# EAGLE board harp behavior v2.0 (EAGLE 9.6.2)
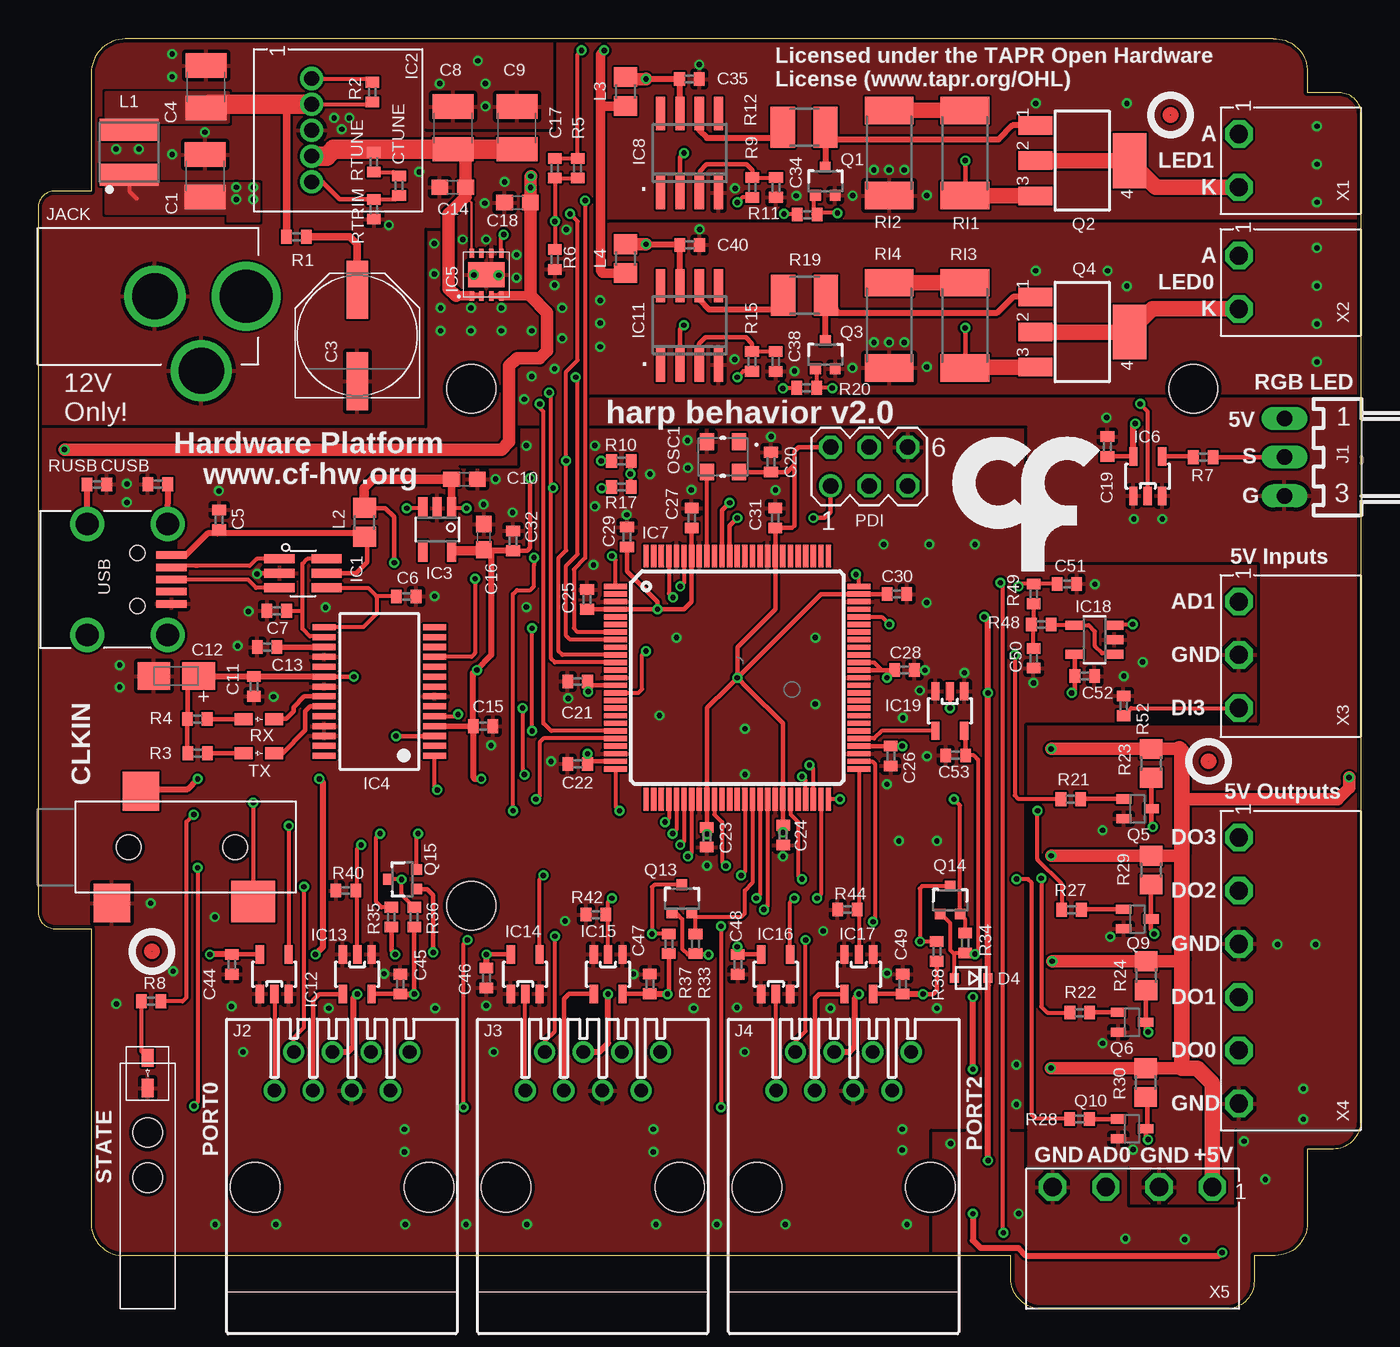
[diagram p4: board, top side]
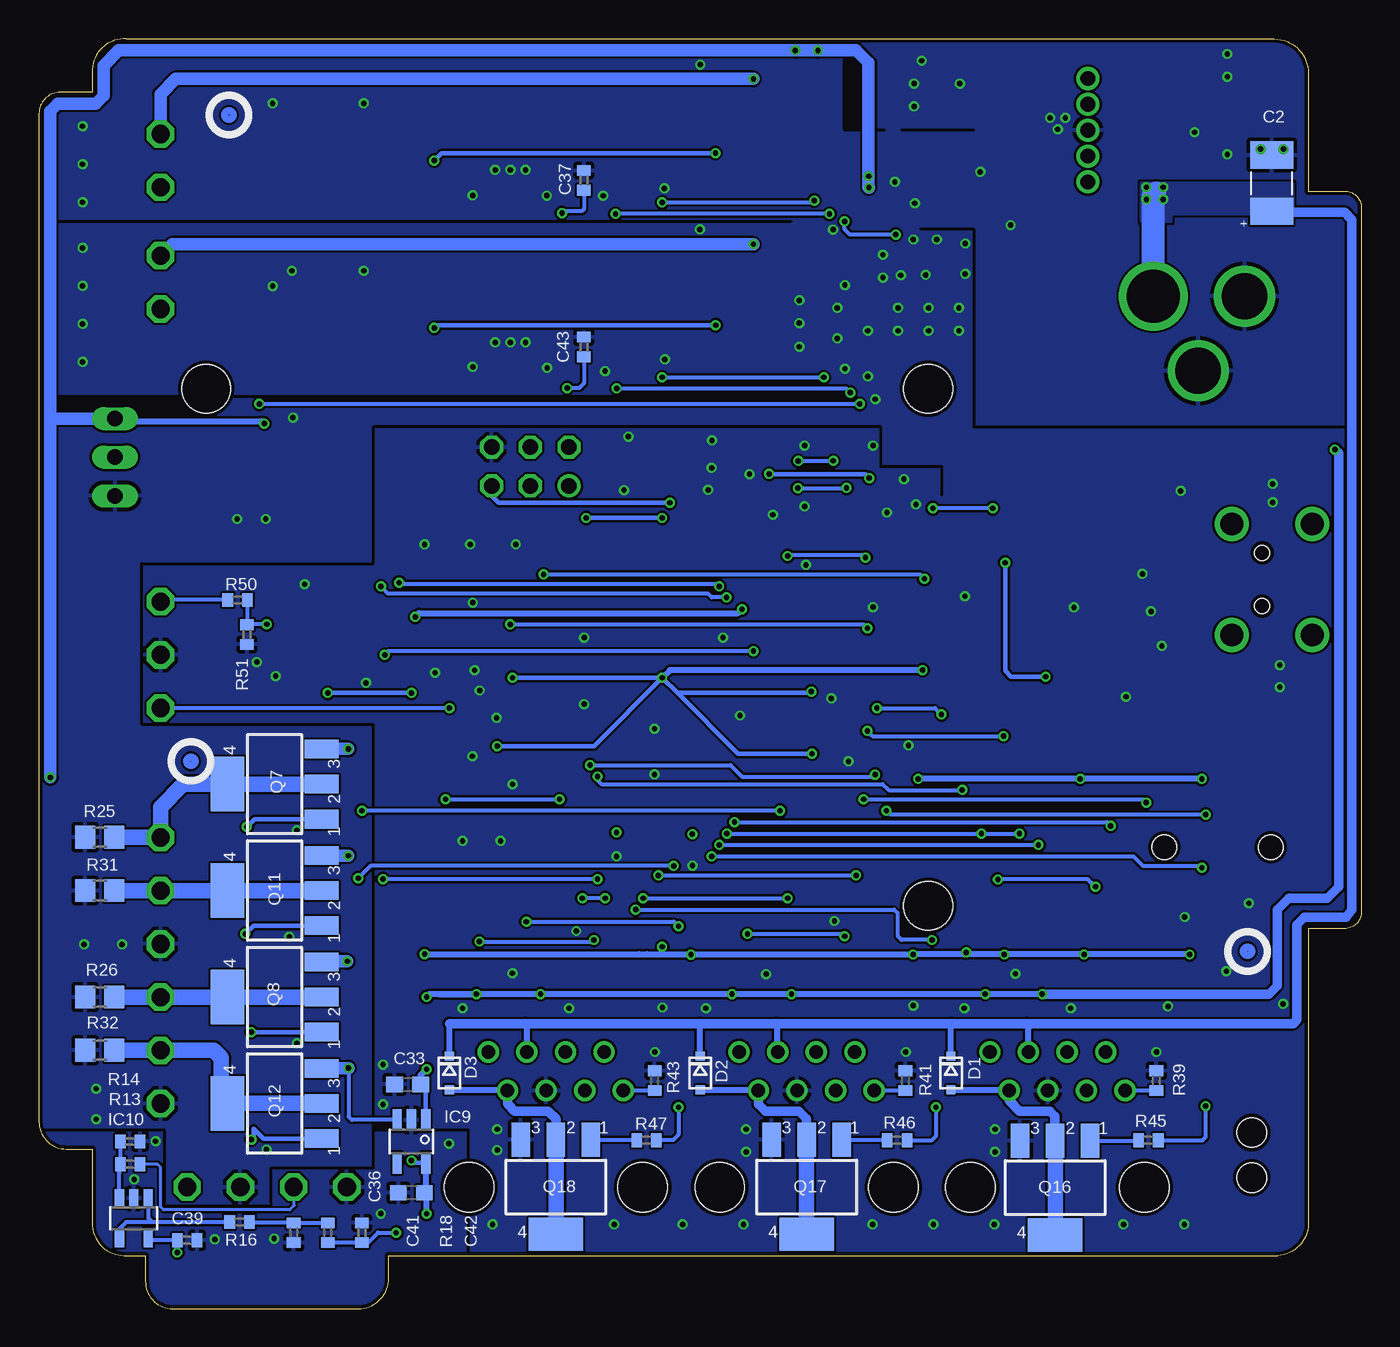
[diagram p5: board, bottom side, seen from below]

Size 87 x 83.5 mm. Coordinates in mm from the lower left corner, seen from the top.
Outline: 3.5,81.26 3.5,73.5 1.12,73.5 arc90 0,72.38 0,26.12 arc90 1.12,25 3.5,25 3.5,5.74 arc90 5.5,3.5 64,3.5 64,1.99 arc90 65.99,0 78.2,0 arc90 80,1.8 80,3.5 81.39,3.5 arc90 83.5,5.61 83.5,10.5 85.2,10.5 arc90 87,12.3 87,78.59 arc90 85.59,80 83.5,80 83.5,81.5 arc90 81.26,83.5 5.74,83.5 arc90 3.5,81.26
Copper layers (1*16): Top 0.035mm / dielectric 1.5mm / Bottom 0.035mm
Design rules "SeeedStudio_2layer_DRU_no_angle_20140221": minimum track width 6mil, minimum drill 12mil, track to track 6mil, track to pad 6mil, pad to pad 6mil, via to via 6mil, smd to smd 0mil, copper to edge 10mil, drill to drill 10mil, minimum pad ring 10mil, minimum via ring 6mil, stop-mask expansion 2mil, vias tented up to drill 100mil, thermal gap 10mil
Holes 3.2 mm at 28.5,60.5 28.5,26.5 76,60.5
tRestrict: 27 lines
bRestrict: 29 lines

## Footprints (pad centres in the part's own frame; a part is rotated, then mirrored left to right if it is on the bottom)
C1210 = smd 1.6 x 2.7: 1 -1.4,0; 2 1.4,0
CAP_100UF_HAND = smd 1.8 x 2.8: + -1.85,0; - 1.85,0
PANASONIC_E = smd 3.8 x 1.4: + 3,0; - -3,0
C0402 = smd 0.7 x 0.9: 1 -0.65,0; 2 0.65,0
C0603 = smd 1.1 x 1: 1 -0.85,0; 2 0.85,0
A/3216-18W = smd 2.15 x 1.8: + 1.475,0; - -1.475,0
35RASMT2BHNTRX = smd 2.4 x 2.55: 1 0.8,3.675; 5 -1.1,-3.675 | smd 2.9 x 2.75: 4 8.2,-3.575 | hole 1.6: 0,0; 7,0
SOD-323-DIODE = smd 0.6 x 0.6: A 1.1,0; C -1.1,0
SOT23-6L = smd 0.6 x 2: P$1 -0.95,-1.55; P$2 0,-1.55; P$3 0.95,-1.55; P$4 0.95,1.55; P$5 0,1.55; P$6 -0.95,1.55
SIP-5 = drill 0.97 pad 1.52: P1 -3.4,0; P2 -1.7,0; P3 0,0; P4 1.7,0; P5 3.4,0
TSOT23-5 = smd 0.6 x 1.408: 1 -0.95,-1.404; 2 0,-1.404; 3 0.95,-1.404; 4 0.95,1.404; 5 -0.95,1.404
SSOP28 = smd 0.4 x 1.5: 1 -4.225,-3.625; 2 -3.575,-3.625; 3 -2.925,-3.625; 4 -2.275,-3.625; 5 -1.625,-3.625; 6 -0.975,-3.625; 7 -0.325,-3.625; 8 0.325,-3.625; 9 0.975,-3.625; 10 1.625,-3.625; 11 2.275,-3.625; 12 2.925,-3.625; 13 3.575,-3.625; 14 4.225,-3.625; 15 4.225,3.625; 16 3.575,3.625; 17 2.925,3.625; 18 2.275,3.625; 19 1.625,3.625; 20 0.975,3.625; 21 0.325,3.625; 22 -0.325,3.625; 23 -0.975,3.625; 24 -1.625,3.625; 25 -2.275,3.625; 26 -2.925,3.625; 27 -3.575,3.625; 28 -4.225,3.625
SON-8 = smd 0.3 x 0.6: P1 -0.975,-1.4; P2 -0.325,-1.4; P3 0.325,-1.4; P4 0.975,-1.4; P5 0.975,1.4; P6 0.325,1.4; P7 -0.325,1.4; P8 -0.975,1.4 | smd 2.4 x 1.65: P9 0,0
SOT23-5 = smd 0.55 x 1.2: 1 -0.95,-1.3; 2 0,-1.3; 3 0.95,-1.3; 4 0.95,1.3; 5 -0.95,1.3
TQFP100 = smd 1.5 x 0.35: 1 -8,6; 2 -8,5.5; 3 -8,5; 4 -8,4.5; 5 -8,4; 6 -8,3.5; 7 -8,3; 8 -8,2.5; 9 -8,2; 10 -8,1.5; 11 -8,1; 12 -8,0.5; 13 -8,0; 14 -8,-0.5; 15 -8,-1; 16 -8,-1.5; 17 -8,-2; 18 -8,-2.5; 19 -8,-3; 20 -8,-3.5; 21 -8,-4; 22 -8,-4.5; 23 -8,-5; 24 -8,-5.5; 25 -8,-6; 51 8,-6; 52 8,-5.5; 53 8,-5; 54 8,-4.5; 55 8,-4; 56 8,-3.5; 57 8,-3; 58 8,-2.5; 59 8,-2; 60 8,-1.5; 61 8,-1; 62 8,-0.5; 63 8,0; 64 8,0.5; 65 8,1; 66 8,1.5; 67 8,2; 68 8,2.5; 69 8,3; 70 8,3.5; 71 8,4; 72 8,4.5; 73 8,5; 74 8,5.5; 75 8,6 | smd 0.35 x 1.5: 26 -6,-8; 27 -5.5,-8; 28 -5,-8; 29 -4.5,-8; 30 -4,-8; 31 -3.5,-8; 32 -3,-8; 33 -2.5,-8; 34 -2,-8; 35 -1.5,-8; 36 -1,-8; 37 -0.5,-8; 38 0,-8; 39 0.5,-8; 40 1,-8; 41 1.5,-8; 42 2,-8; 43 2.5,-8; 44 3,-8; 45 3.5,-8; 46 4,-8; 47 4.5,-8; 48 5,-8; 49 5.5,-8; 50 6,-8; 76 6,8; 77 5.5,8; 78 5,8; 79 4.5,8; 80 4,8; 81 3.5,8; 82 3,8; 83 2.5,8; 84 2,8; 85 1.5,8; 86 1,8; 87 0.5,8; 88 0,8; 89 -0.5,8; 90 -1,8; 91 -1.5,8; 92 -2,8; 93 -2.5,8; 94 -3,8; 95 -3.5,8; 96 -4,8; 97 -4.5,8; 98 -5,8; 99 -5.5,8; 100 -6,8
SO8 = smd 0.6 x 2.2: 1 -1.905,-2.6; 2 -0.635,-2.6; 3 0.635,-2.6; 4 1.905,-2.6; 5 1.905,2.6; 6 0.635,2.6; 7 -0.635,2.6; 8 -1.905,2.6
SOT23-5' = smd 0.6 x 1.2: 1 -0.95,-1.306; 2 0,-1.306; 3 0.95,-1.306; 4 0.95,1.306; 5 -0.95,1.306
7395-03 = drill 1.016 long: 1 2.54,0; 2 0,0; 3 -2.54,0
520426-4 = drill 0.889: 1 -4.445,6.35; 2 -3.175,8.89; 3 -1.905,6.35; 4 -0.635,8.89; 5 0.635,6.35; 6 1.905,8.89; 7 3.175,6.35; 8 4.445,8.89 | hole 3.251: -5.715,0; 5.715,0
DC_POWER_INPUT_2.1MM = drill 3.5: P1 8.5,0 | drill 3: P2 2.5,0; P3 5.55,-4.9
IND_LPS4012_V2 = smd 1.45 x 3.89: 1 -1.475,0; 2 1.475,0
R0805 = smd 1.3 x 1.5: 1 -0.95,0; 2 0.95,0
OSCILLATOR_3.2X2.5 = smd 0.9 x 1.1: P$1 -1.05,-1; P$2 1.05,-1; P$3 1.05,1; P$4 -1.05,1
MA03-2 = drill 1.016: 1 -2.54,-1.27 | drill 1.016 octagon: 2 -2.54,1.27; 3 0,-1.27; 4 0,1.27; 5 2.54,-1.27; 6 2.54,1.27
SOT323 = smd 0.7 x 0.7: 1 -0.65,-0.925; 2 0.65,-0.925; 3 0,0.925
SOT223 = smd 1.219 x 2.235: 1 -2.311,-3.099; 2 0,-3.099; 3 2.311,-3.099 | smd 3.6 x 2.2: 4 0,3.099
SOT323-BEC = smd 0.6 x 1: B -0.65,-0.9; C 0,0.9; E 0.65,-0.9
R0402 = smd 0.7 x 0.9: 1 -0.65,0; 2 0.65,0
R1210 = smd 1.6 x 2.7: 1 -1.4,0; 2 1.4,0
R2512 = smd 1.8 x 3.2: 1 -2.8,0; 2 2.8,0
LED_HAND = smd 1.2 x 0.8: A -1,0; K 1,0
LED_PIPE_7513D2-L = hole 1.93: -1.486,0; 1.486,0
240-0002-1 = smd 0.5 x 2: P$1 -1.6,8.65; P$2 -0.8,8.65; P$3 0,8.65; P$4 0.8,8.65; P$5 1.6,8.65 | drill 1.5: SHIELD_1 -3.65,3.1; SHIELD_2 3.65,3.1; SHIELD_3 3.65,8.4; SHIELD_4 -3.65,8.4 | hole 1: -1.75,6.4; 1.75,6.4
CON_3.5MM_1X2 = drill 1.2 octagon: P1 -1.75,0; P2 1.75,0
CON_3.5MM_1X3 = drill 1.2 octagon: P1 -3.5,0; P2 0,0; P3 3.5,0
CON_3.5MM_1X6 = drill 1.2 octagon: P1 -8.44,-2.54; P2 -4.94,-2.54; P3 -1.44,-2.54; P4 2.06,-2.54; P5 5.56,-2.54; P6 9.06,-2.54
CON_3.5MM_1X4 = drill 1.2 octagon: P1 -5.25,0; P2 -1.75,0; P3 1.75,0; P4 5.25,0

## Placement (x,y rotation side)
C1  22uF  [C1210]  11,74.5 90 top
C2  22uF  [CAP_100UF_HAND]  5.9,74.02 90 bottom
C3  100uF  [PANASONIC_E]  21,64 90 top
C4  22uF  [C1210]  11.05,80.35 90 top
C5  100nF  [C0402]  11.92,51.88 90 top
C6  47pF  [C0402]  24.22,46.84 0 top
C7  47pF  [C0402]  15.71,45.9 180 top
C8  47uF  [C1210]  27.3,77.65 90 top
C9  47uF  [C1210]  31.5,77.65 90 top
C10  10uF  [C0603]  28.05,54.54 0 top
C11  100nF  [C0402]  14.21,40.93 270 top
C12  4.7uF  [A/3216-18W]  9.09,41.61 0 top
C13  100nF  [C0402]  15.08,43.51 180 top
C14  10uF  [C0603]  27.28,73.76 180 top
C15  100nF  [C0402]  29.28,38.3 0 top
C16  10uF  [C0603]  29.33,50.75 90 top
C17  13pF  [C0402]  34,75 270 top
C18  10uF  [C0603]  31.54,72.74 180 top
C19  100nF  [C0402]  70.35,56.7 90 top
C20  100nF  [C0402]  48.22,55.67 90 top
C21  100nF  [C0402]  35.5,41.25 180 top
C22  100nF  [C0402]  35.5,35.83 180 top
C23  100nF  [C0402]  44,31.01 270 top
C24  100nF  [C0402]  49.01,31.15 270 top
C25  100nF  [C0402]  36.11,46.65 90 top
C26  100nF  [C0402]  56.1,36.35 270 top
C27  100nF  [C0402]  43,52 90 top
C28  100nF  [C0402]  57,42 0 top
C29  330nF  [C0402]  38.75,50.75 90 top
C30  100nF  [C0402]  56.5,47 0 top
C31  100nF  [C0402]  48.5,52 90 top
C32  330nF  [C0402]  31.25,50.5 90 top
C33  10uF  [C0603]  62.75,14.75 180 bottom
C34  NA  [C0402]  48.55,73.74 270 top
C35  100nF  [C0402]  42.85,80.87 0 top
C36  10uF  [C0603]  62.5,7.62 180 bottom
C37  100nF  [C0402]  51.15,74.2 90 bottom
C38  NA  [C0402]  48.53,62.29 270 top
C39  100nF  [C0402]  77.25,4.5 0 bottom
C40  100nF  [C0402]  42.86,69.96 0 top
C41  15nF 5%  [C0402]  70.25,5 90 bottom
C42  15nF 5%  [C0402]  65.75,5 270 bottom
C43  100nF  [C0402]  51.15,63.25 90 bottom
C44  100nF  [C0402]  12.75,22.65 270 top
C45  100nF  [C0402]  23.83,21.35 90 top
C46  100nF  [C0402]  29.5,21.75 270 top
C47  100nF  [C0402]  40.25,21.36 90 top
C48  100nF  [C0402]  46.04,22.64 270 top
C49  100nF  [C0402]  56.88,21.34 90 top
C50  15nF 5%  [C0402]  65.49,42.78 90 top
C51  15nF 5%  [C0402]  67.68,47.66 180 top
C52  100nF  [C0402]  68.86,41.61 0 top
C53  100nF  [C0402]  60.37,36.39 180 top
CLKIN  [35RASMT2BHNTRX]  5.96,30.36 0 top
CTUNE  NA  [C0402]  23.75,73.85 270 top
CUSB  4.7nF  [C0402]  7.88,54.22 180 top
D1  NA  [SOD-323-DIODE]  27,15.5 270 bottom
D2  NA  [SOD-323-DIODE]  43.5,15.5 270 bottom
D3  NA  [SOD-323-DIODE]  60,15.5 270 bottom
D4  NA  [SOD-323-DIODE]  61.38,21.75 180 top
IC1  USBLC6-2SC6  [SOT23-6L]  17.44,48.36 270 top
IC2  DC-DC-SIP-5  [SIP-5]  18,77.5 270 top
IC3  LP5907MFX-3.3  [TSOT23-5]  26.27,51.24 180 top
IC4  FT232RL  [SSOP28]  22.45,40.59 90 top
IC5  TPS78601SON  [SON-8]  29.5,68 0 top
IC6  M74VHC1GT50DTT1G  [SOT23-5]  73,54.75 0 top
IC7  XMEGA-A1TQFP  [TQFP100]  46,41.5 0 top
IC8  [SO8]  42.86,76 0 top
IC9  LP5907MFX-3.3  [TSOT23-5]  62.5,11 180 bottom
IC10  OPA365  [SOT23-5']  80.76,5.95 180 bottom
IC11  [SO8]  42.86,64.67 0 top
IC12  SN74LVC1G125  [SOT23-5]  15.54,22 0 top
IC13  M74VHC1GT50DTT1G  [SOT23-5]  21,22 180 top
IC14  SN74LVC1G125  [SOT23-5]  32.05,22 0 top
IC15  M74VHC1GT50DTT1G  [SOT23-5]  37.5,22 180 top
IC16  SN74LVC1G125  [SOT23-5]  48.53,22 0 top
IC17  M74VHC1GT50DTT1G  [SOT23-5]  54,22 180 top
IC18  OPA365  [SOT23-5']  69.5,44 90 top
IC19  SN74LVC1G125  [SOT23-5]  59.98,39.31 180 top
J1  22-05-7038-03  [7395-03]  82,56 90 top
J2  Port 0  [520426-4]  20,8 0 top
J3  Port 1  [520426-4]  36.5,8 0 top
J4  Port 2  [520426-4]  53,8 0 top
JACK  DC_JACK2.1MM  [DC_POWER_INPUT_2.1MM]  5.19,66.58 0 top
L1  1.5u  [IND_LPS4012_V2]  6,76.05 90 top
L2  ???  [R0805]  21.48,51.72 270 top
L3  600@100M  [R0805]  38.65,80.04 90 top
L4  600@100M  [R0805]  38.65,69.06 90 top
OSC1  OSCILLATOR  [OSCILLATOR_3.2X2.5]  45.06,56.02 180 top
PDI  [MA03-2]  54.68,55.39 0 top
Q1  MOSFET-NCHANNELSOT323  [SOT323]  51.79,74.15 0 top
Q2  [SOT223]  68.7,75.5 270 top
Q3  MOSFET-NCHANNELSOT323  [SOT323]  51.8,62.74 0 top
Q4  [SOT223]  68.7,64.23 270 top
Q5  BC817-40W  [SOT323-BEC]  72.33,32.88 270 top
Q6  BC817-40W  [SOT323-BEC]  71.96,18.84 270 top
Q7  [SOT223]  71.5,34.5 90 bottom
Q8  [SOT223]  71.5,20.5 90 bottom
Q9  BC817-40W  [SOT323-BEC]  72.32,25.63 270 top
Q10  BC817-40W  [SOT323-BEC]  71.96,11.83 270 top
Q11  [SOT223]  71.5,27.5 90 bottom
Q12  [SOT223]  71.5,13.5 90 bottom
Q13  MOSFET-NCHANNELSOT323  [SOT323]  42.35,26.95 0 top
Q14  MOSFET-NCHANNELSOT323  [SOT323]  60,26.88 0 top
Q15  MOSFET-NCHANNELSOT323  [SOT323]  23.98,28.25 90 top
Q16  [SOT223]  20.15,7.96 180 bottom
Q17  [SOT223]  36.5,8 180 bottom
Q18  [SOT223]  53,8 180 bottom
R1  0  [R0402]  17,70.5 180 top
R2  NA  [R0402]  22,80 270 top
R3  2050 NA  [R0402]  10.5,36.53 180 top
R4  680 NA  [R0402]  10.48,38.77 180 top
R5  95.3k  [R0402]  35.5,75 90 top
R6  30.9k  [R0402]  34,69 90 top
R7  100  [R0402]  76.65,56 180 top
R8  68  [R0402]  7.44,20.22 0 top
R9  0  [R0402]  46.99,73.73 90 top
R10  100k  [R0402]  38.38,55.75 180 top
R11  100  [R0402]  50.6,71.95 0 top
R12  200  [R1210]  50.4,77.7 0 top
R13  24k  [R0402]  81,9.5 0 bottom
R14  15k  [R0402]  81,11 180 bottom
R15  0  [R0402]  46.97,62.3 90 top
R16  10k 1%  [R0402]  73.8,5.7 0 bottom
R17  100k  [R0402]  38.38,54.04 180 top
R18  10k 1%  [R0402]  68,5 270 bottom
R19  200  [R1210]  50.43,66.65 0 top
R20  100  [R0402]  50.56,60.56 0 top
R21  10k  [R0402]  67.94,33.51 0 top
R22  10k  [R0402]  68.53,19.47 0 top
R23  549  [R0805]  73.22,35.86 270 top
R24  549  [R0805]  72.89,21.9 270 top
R25  549  [R0805]  83,31 0 bottom
R26  549  [R0805]  83,20.5 0 bottom
R27  10k  [R0402]  67.98,26.23 0 top
R28  10k  [R0402]  68.51,12.48 0 top
R29  549  [R0805]  73.22,28.84 270 top
R30  549  [R0805]  72.86,14.87 270 top
R31  549  [R0805]  83,27.5 0 bottom
R32  549  [R0805]  83,17 0 bottom
R33  10k  [R0402]  43.25,24 90 top
R34  10k  [R0402]  60.99,24.05 90 top
R35  10k  [R0402]  23.25,25.75 90 top
R36  10k  [R0402]  24.75,25.75 90 top
R37  10k  [R0402]  41.5,24 90 top
R38  10k  [R0402]  59.12,23.5 90 top
R39  100k  [R0402]  13.5,15 90 bottom
R40  100k  [R0402]  20.25,27.5 0 top
R41  100k  [R0402]  30,15 90 bottom
R42  100k  [R0402]  36.7,25.92 0 top
R43  100k  [R0402]  46.5,15 90 bottom
R44  100k  [R0402]  53.25,26.25 180 top
R45  330  [R0402]  14.02,11.08 180 bottom
R46  330  [R0402]  30.54,11.08 180 bottom
R47  330  [R0402]  47.03,11.08 180 bottom
R48  10k 1%  [R0402]  66,45 180 top
R49  10k 1%  [R0402]  65.5,47.01 90 top
R50  24k  [R0402]  73.93,46.61 180 bottom
R51  15k  [R0402]  73.31,44.33 90 bottom
R52  100k  [R0402]  71.41,39.64 90 top
RI1  4.99  [R2512]  60.98,76 270 top
RI2  4.99  [R2512]  56,76 90 top
RI3  4.99  [R2512]  60.98,64.67 270 top
RI4  4.99  [R2512]  56,64.67 90 top
RTRIM  243  [R0402]  22.1,72.3 90 top
RTUNE  NA  [R0402]  22.1,75.4 90 top
RUSB  1M  [R0402]  3.87,54.2 0 top
RX  GREEN NA  [LED_HAND]  14.53,38.77 0 top
STATE  GREEN  [LED_HAND]  7.21,15.51 270 top
TX  RED NA  [LED_HAND]  14.53,36.53 0 top
U$1  [LED_PIPE_7513D2-L]  7.21,10.11 90 top
U$2  [FIDUCIAL]  77,36 0 top
U$3  [FIDUCIAL]  74.5,78.5 0 top
U$4  [FIDUCIAL]  7.5,23.5 0 top
U$5  [FIDUCIAL]  7.5,23.5 0 bottom
U$6  [FIDUCIAL]  77,36 0 bottom
U$7  [FIDUCIAL]  74.5,78.5 0 bottom
U$9  [LOGO_6]  63.33,54.25 0 top
USB  [240-0002-1]  0.13,47.96 270 top
X1  CON_3.5MM_1X2  [CON_3.5MM_1X2]  79,75.5 270 top
X2  CON_3.5MM_1X2  [CON_3.5MM_1X2]  79,67.5 270 top
X3  CON_3.5MM_1X3  [CON_3.5MM_1X3]  79,43 270 top
X4  CON_3.5MM_1X6  [CON_3.5MM_1X6]  81.54,22.55 270 top
X5  CON_3.5MM_1X4  [CON_3.5MM_1X4]  72,8 180 top

## Tracks (layer width: path | path; a pad name or v marks a point on that pad's centre or on a via)
5V_RAW  (via drill 0.35 pad 0.65)
  Top 0.254: IC3.3 v24.27,52.65 v24.26,52.64 | v28.2,52.64 27.22,52.64 IC3.1
  Top 0.305: 16.31,41.56 C11.1 | v20.78,41.55 IC4.20 | R3.2 9.83,36.55 R4.2 9.84,38.79 9.84,41.45 9.7,41.59 10.56,41.59 C12.+ | v23.43,49.06 23.43,52.07 22.85,52.65 21.49,52.65 L2.1 | IC3.1
  Top 0.406: IC4.20 16.31,41.56 10.61,41.56 C12.+ | L2.1 21.54,52.72
  Top 0.508: IC3.1 C10.1
  Top 0.61: C10.1 22.05,54.55 21.45,53.95 21.45,52.69 L2.1
  Bottom 0.254: v24.26,52.64 v28.2,52.64
  Bottom 0.305: v23.43,49.06 23.43,41.96 23.06,41.57 22.7,41.57 v20.78,41.55
+5V  (via drill 0.35, 0.35 pad 0.65)
  Top 0.254: C17.1 R5.2 35.5,82.49 v35.76,82.75
  Top 0.305: C47.1 IC15.5 | IC17.5 57.13,20.7 C49.1 | IC13.5 C45.1 | R36.1 v24.75,20.7 | R37.1 41.5,20.79 v41.41,20.7 | R38.1 59.12,20.95 58.86,20.69 v58.23,20.69 v58.22,20.69 | C19.1 IC6.5
  Top 0.406: C45.1 v24.75,20.7 | v58.22,20.69 57.14,20.69 C49.1 | J2.4 20.39,16.89 20.75,17.25 20.75,20.45 v21,20.7 | v37.5,20.7 37.5,17.46 36.91,16.88 35.88,16.88 J3.4 | C47.1 41.23,20.71 v41.41,20.7 | J4.4 53.39,16.89 53.75,17.25 53.75,20.45 v54,20.7 | v61.5,15.75 v61.5,20.5 | IC6.5 72.05,58.08 v72.17,58.2 | IC5.P3 IC5.P4
  Top 0.61: 37,79 37,68.25 37.15,68.11 L4.1 | 37,79 37,82.5 v37.25,82.75 | L3.1 37.09,79.09 37,79 | IC5.P4 32.4,66.6
  Top 0.813: v66.65,36.81 R23.1 75.06,36.81 | 75.25,30 75.04,29.79 R29.1 v66.66,29.79 v66.65,29.79 | v66.72,22.85 66.92,22.85 R24.1 75.1,22.85 75.25,23 | 75.25,15.82 R30.1 66.66,15.82 v66.64,15.83 | v1.75,56.5 30.5,56.5 31,57 31,62 31.5,62.5 33,62.5 33.5,63 33.5,65.5 32.4,66.6 32.39,66.61 C18.1 | v86.25,34.94 86.25,34.25 85.5,33.5 75.25,33.5 | v32.4,73.72 32.4,72.76 C18.1 | C18.1 32.39,74.45 v32.42,74.48
  Top 1.016: X5.P1 77.25,14.82 76.25,15.82 75.25,15.82 75.25,23 75.25,30 75.25,33.5 75.25,36.63 75.06,36.81
  Bottom 0.254: IC9.3 63.46,12.42 66.42,12.42 66.64,12.64 v66.64,15.83
  Bottom 0.305: IC9.1 61.55,14.4 C33.1
  Bottom 0.406: 60.72,20.7 v54,20.7 v41.41,20.7 v37.5,20.7 v24.75,20.7 v21,20.7 IC13.5 | 60.72,20.7 v58.22,20.69 | C33.1 61.9,15.35 v61.5,15.75 | 60.72,20.7 61.3,20.7 v61.5,20.5 | 82.04,58.5 J1.1 81.83,58.37 72.34,58.37 v72.17,58.2
  Bottom 0.61: v21,20.7 6.1,20.7 5.55,21.25 5.55,26.25 4.8,27 2.25,27 1.5,27.75 1.5,56.25 v1.75,56.5
  Bottom 0.813: v66.65,29.79 68.29,29.79 Q11.3 | v66.65,36.81 68.29,36.81 Q7.3 | v66.72,22.85 68.36,22.85 Q8.3 | Q12.3 68.38,15.83 v66.64,15.83 | v86.25,34.94 86.25,58.5 | 86.25,58.5 86.25,78.75 85.75,79.25 83.25,79.25 82.75,79.75 82.75,81.75 81.75,82.75 v37.25,82.75 v35.76,82.75 33.25,82.75 32.42,81.92 v32.42,74.48 32.42,73.74 v32.4,73.72 | J1.1 86.21,58.54 86.25,58.5
+12V  (via drill 0.35 pad 0.65)
  Top 0.254: L1.1 6,73.5 6.5,73
  Bottom 0.254: C2.+ 5.9,72.1 6,72
  Bottom 0.406: J2.6 21.91,18.66 | D1.C 27,18.75 | J3.6 38.41,18.66 38.5,18.75 | D2.C 43.5,18.75 | J4.6 54.91,18.66 55,18.75 | D3.C 60,18.75
  Bottom 0.61: 60,18.75 55,18.75 43.5,18.75 38.5,18.75 27,18.75 22,18.75 | 21.91,18.66 22,18.75 | 22,18.75 4.5,18.75 4.25,19 4.25,25.25 3.75,25.75 1,25.75 0.62,26.25 0.62,71.62 1.1,72.1 5.9,72.1 6,72
  Bottom 1.27: 13.69,73.31 13.5,73.5
  Bottom 1.524: JACK.P1 13.69,73.31
  other vias: 14.15,73.75 13.05,73.75 14.15,72.95 13.05,72.95
  pour Top (no thermals): 4.5,74 14.5,74 14.5,71.5 12.5,71.5 12.5,72 4.5,72
  pour Bottom (no thermals): 4.5,74 14.5,74 14.5,71.5 12.5,71.5 12.5,72 4.5,72
ADC0  (via drill 0.35 pad 0.65)
  Top 0.254: IC7.95 42.5,47.75 v42.25,47.5 | v63.31,47.74 63.46,47.59 63.46,5.04 v63.5,5
  Bottom 0.254: R18.2 C42.2 65.35,4.35 64.7,5 v63.5,5 | v42.25,47.5 42.41,47.66 63.23,47.66 v63.31,47.74
ADC0_IN
  Bottom 0.203: R13.2 79.2,9.5 79,9.3 79,6.7 78.8,6.5 70.5,6.5 70.2,6.8 70.2,7.95 X5.P3
ADC1  (via drill 0.35 pad 0.65)
  Top 0.254: C51.2 R49.2 64.66,47.66 v64.5,47.5 | v41.77,46.77 41.76,46.77 41.5,47.03 IC7.97
  Bottom 0.254: v41.77,46.77 42.73,46.77 43.01,47.05 64.05,47.05 v64.5,47.5
ADC1_IN
  Bottom 0.254: R50.2 78.89,46.61 X3.P1
C_M0  (via drill 0.35 pad 0.65)
  Top 0.305: IC8.2 42.23,75.72 v42.5,76 | v61,75.5 61,73.22
  Top 0.406: 61,73.22 RI1.2
  Top 1.016: Q2.3 60.99,73.19 RI1.2
  Bottom 0.305: v42.5,76 60.5,76 v61,75.5
C_M1  (via drill 0.35 pad 0.65)
  Top 0.203: 60.34,61.92 60.32,61.94 | 60.77,61.94 RI3.2
  Top 0.254: 60.77,61.94 60.37,61.94 60.34,61.92 | 61,61.89 61.07,61.89 61.1,61.92
  Top 0.305: IC11.2 42.23,64.41 v42.48,64.67 | v61,64.5 61,61.89 RI3.2
  Top 0.406: 65.65,61.87 Q4.3 | RI3.2 60.84,62.34 61,62.5 61,62.03 RI3.2
  Top 1.016: Q4.3 61.1,61.92
  Bottom 0.305: v42.48,64.67 60.83,64.67 v61,64.5
CLK_IN  (via drill 0.35 pad 0.65)
  Top 0.254: IC7.21 33.25,37.5 33,37.25 33,33.75 v32.75,33.5 | v14.16,33.29 CLKIN.4
  Bottom 0.254: v32.75,33.5 14.38,33.5 v14.16,33.29
CTRL_BL
  Top 0.406: IC11.6 43.5,67.62 43.5,66.38 44.15,65.72 48.37,65.72 R19.1
CTRL_BL1
  Top 0.406: IC8.6 43.49,77.5 44,77 48.5,77 R12.1
DAC0  (via drill 0.35 pad 0.65)
  Top 0.254: IC7.8 35,44 34.75,44.25 34.75,48.88 35.5,49.62 35.5,61.12 v35.38,61.25 | R15.1 46.4,61.65 v46,61.25
  Bottom 0.254: v46,61.25 v35.38,61.25
DAC1  (via drill 0.35 pad 0.65)
  Top 0.254: IC7.7 35.5,44.5 35.25,44.75 35.25,48.62 36,49.38 v36,72.88 | R9.1 46.33,73.08 v46,72.75
  Bottom 0.254: v46,72.75 36,72.75 v36,72.88
DCIN
  Top 0.254: IC2.P2 21.85,79.2 R2.2
  Top 0.305: 16.35,79.05 16.5,79.2
  Top 0.508: R1.2 16.35,79.05
  Top 1.27: IC2.P2 16.5,79.2 11.3,79.2 C4.1
  pour Top (no thermals): 12.5,80 12.5,78 4.5,78 4.5,80
DI3  (via drill 0.35 pad 0.65)
  Top 0.254: R52.1 71.91,39.5 X3.P3 | IC19.2 60,40.6 v60,39.5
  Bottom 0.254: v60,39.5 X3.P3
DI_PK0
  Top 0.254: IC12.2 15.55,20.14 J2.1
  Bottom 0.254: R39.1 J2.1
DI_PK1
  Top 0.254: J3.1 IC14.2
  Bottom 0.254: R41.1 J3.1
DI_PK2
  Top 0.254: IC16.2 48.52,14.38 J4.1
  Bottom 0.254: R43.1 J4.1
DIO_PK0  (via drill 0.35 pad 0.65)
  Top 0.254: J2.2 16.82,17.82 17.5,18.5 v17.5,27.75 | Q15.3 23.07,28.23 v23.92,28.23 23.92,27.23 R36.2
  Bottom 0.254: v17.5,27.75 17.8,28.03 18,28.23 v23.92,28.23
DIO_PK1  (via drill 0.35 pad 0.65)
  Top 0.254: J3.2 33.33,17.57 34,18.25 v34,24.5 | R37.2 v40.39,24.65 v40.38,24.66 40.38,27.72 40.54,27.88 Q13.3
  Bottom 0.254: v40.39,24.65 34.15,24.65 v34,24.5
DIO_PK2  (via drill 0.35 pad 0.65)
  Top 0.254: J4.2 49.83,17.57 50.5,18.25 v50.5,24.25 | R38.2 v58.02,24.15 58,24.18 58,27.62 58.17,27.8 Q14.3
  Bottom 0.254: v58.02,24.15 50.65,24.15 v50.5,24.25
DO0
  Bottom 0.406: 75,13.5 74,13.5
  Bottom 1.016: Q12.2 74,13.5 Q12.4 | 75,13.5 75,16.5 75.5,17 X4.P5 R32.2
DO1
  Bottom 1.016: Q8.2 Q8.4 X4.P4 R26.2
DO2
  Bottom 1.016: Q11.2 Q11.4 X4.P2 | X4.P2 | X4.P2 R31.2
DO3
  Bottom 1.016: Q7.2 Q7.4 77.5,34.5 79.01,32.99 X4.P1 | X4.P1 | X4.P1 R25.2
DO_PK0
  Top 0.305: J2.3 18.09,19.09 18.09,20.3 18.5,20.7 IC13.4
DO_PK1
  Top 0.305: J3.3 34.59,20.38 34.92,20.71 IC15.4
DO_PK2
  Top 0.305: J4.3 51.09,20.41 51.38,20.7 IC17.4
FT_CTS  (via drill 0.35 pad 0.65)
  Top 0.254: IC7.75 54,48.1 v53.81,48.29 | v28.75,48 28.75,43.11 28.51,42.86 26.1,42.86 26.09,42.88
  Top 0.305: 26.09,42.88 IC4.11
  Bottom 0.254: v53.81,48.29 29.04,48.29 v28.75,48
FT_RTS  (via drill 0.35 pad 0.65)
  Top 0.254: IC7.71 55.5,45.5 v56,45 | v32.5,38 v32.5,44.75
  Top 0.305: v23.55,37.66 IC4.3
  Bottom 0.254: v23.55,37.66 32.16,37.66 v32.5,38 | v56,45 32.75,45 v32.5,44.75
FT_RXD  (via drill 0.35 pad 0.65)
  Top 0.254: IC7.48 51,35.5 v50.75,35.75 | IC4.5 27.5,38.96 v27.63,39.08 | v31.88,39.5 31.88,35.25 v32,35.12
  Top 0.305: IC4.5
  Bottom 0.254: v50.75,35.75 41.5,35.75 40.75,35 32.12,35 v32,35.12 | v31.88,39.5 28.05,39.5 v27.63,39.08
FT_TXD  (via drill 0.35 pad 0.65)
  Top 0.254: IC7.47 50.5,34.75 v50.25,35 | 26.06,36.39 26.06,34.33 v26.27,34.12
  Top 0.406: 26.06,36.39 IC4.1
  Bottom 0.254: v50.25,35 50.25,34.75 50,34.5 31.5,34.5 31.1,34.1 26.29,34.1 v26.27,34.12
GND  (via drill 0.35 pad 0.65)
  Top 0.305: IC1.P$2 14.44,48.36 v14.4,48.32
  other vias: 18.92,46.12 5.85,54.24 5.85,53.02 11.89,53.78 26.09,46.85 13.84,45.86 13.13,43.59 15.5,40.25 5.38,42.33 5.38,40.88 5.16,20.04 54.99,63.55 56.99,63.55 55.99,63.55 53.57,61.87 58.47,61.93 54.99,74.89 56.99,74.89 55.99,74.89 53.59,73.2 58.46,73.22 49.88,73.19 49.77,61.66 45.86,73.67 45.83,62.43 43.52,70.98 43.5,81.82 34.88,40.14 33.75,35.99 44.01,29.14 49.01,29.75 55.85,34.49 58.35,41.98 58.46,46.43 48.52,53.84 42.98,53.85 46.51,35.14 39.16,22.01 55.86,22.06 22.76,22.03 29.8,37.04 36.55,48.91 38.73,52.21 70.29,58.6 29.31,52.89 31.22,52.36 30.1,54.56 48.23,57.35 46.51,38.14 72.09,51.93 73.97,51.93 45.98,19.81 29.48,19.93 12.73,19.88 64.51,6.26 64.36,13.43 64.36,16.06 40.88,39.01 51.13,39.76 42.01,44.14 51.13,44.14 56.86,11.81 56.86,10.43 40.48,11.81 40.48,10.31 24.11,10.31 24.11,11.81 42.73,57.1 55.63,50.26 81.53,23.96 84.03,23.96 83.23,14.46 83.23,12.46 58.63,50.26 61.63,50.26 42.75,55.29 36.63,56.76 40.26,54.89 36.63,52.76 32.13,56.76 36.98,63.26 34.67,25.5 43.13,19.76 59.13,19.76 52.13,19.76 26.13,19.76 19.13,19.76 7.41,26.67 8.89,22.2 11.63,25.76 60.94,41.82 58.01,40.66 58.48,36.33 56.9,38.85 56.63,30.76 59.13,30.76 65.63,68.26 71.63,67.25 71.63,79.26 65.63,79.26 84.13,77.76 84.13,75.26 84.13,72.76 84.13,69.76 84.13,67.26 84.13,64.76 84.13,62.26 60.03,10.86 75.43,4.56 79.33,11.01 80.73,8.51 71.53,4.61 5.13,76.26 6.63,76.26 10.98,77.36 8.83,82.51 8.83,81.01 28.48,65.81 30.48,65.81 30.48,64.31 28.48,64.31 33.98,67.31 32.48,64.31 26.48,65.81 26.48,64.31 19.48,78.31 20.48,78.31 19.98,77.56 8.83,75.91 25.08,74.76 29.43,79.06 29.43,80.56 26.43,80.56 28.93,82.06 13.48,16.88 29.98,16.88 46.48,16.88 57.16,5.54 49.16,5.54 40.66,5.54 32.16,5.54 24.16,5.54 15.66,5.54 44.66,5.54 28.16,5.54 11.66,5.54 34.75,70.96 51.65,24.84 32.13,46.14 70.36,68.26 23.08,71.26 72.67,42.53 71.43,41.61 69.52,47.64 65.49,41.16 70.03,17.46 72.03,10.46 70.53,24.46 70.03,31.46 30.7,74.1 29.39,72.7 30.31,67.96 28.67,67.98 29.48,70.31 31.48,69.31 31.48,67.81 27.94,70.31 26.07,70.05 26.07,68.05 34.48,65.81 34.48,63.81 33.98,61.81 32.48,61.31 31.98,59.81 36.98,64.81 36.98,66.31
  pour Bottom (rank 2): 64.11,-0.06 83.5,-0.06 83.5,10.5 87,10.5 87,80 83.5,80 83.5,83.5 3.5,83.5 3.5,73.5 0,73.5 0,25 3.5,25 3.5,3.5 64.11,3.5
  pour Top (rank 2): 83.5,-0.06 83.5,10.5 87,10.5 87,80 83.5,80 83.5,83.5 3.5,83.5 3.5,73.5 0,73.5 0,25 3.5,25 3.5,3.5 64.11,3.5 64.11,-0.06
I_OFF_DAC0  (via drill 0.35, 0.35 pad 0.65)
  Top 0.254: IC7.11 34,42.5 33.75,42.75 33.75,54.25 | 33.75,54.25 33.75,60.12 v33.62,60.25 | v49,60.53 49.12,60.56 R20.1 | R17.2 37.65,53.96 v37.08,53.96 | v33.88,53.98 33.88,54.12 33.75,54.25
  Bottom 0.254: v49,60.53 33.9,60.53 v33.62,60.25 | v37.08,53.96 v37.07,53.97 v33.89,53.97 v33.88,53.98
I_OFF_DAC1  (via drill 0.35 pad 0.65)
  Top 0.254: IC7.10 34.5,43 34.25,43.25 34.25,49.38 34.75,49.88 v34.75,55.76 34.75,61.62 35.5,62.38 35.5,71.5 v35,72 | R10.2 v37.05,55.76 | v49.07,72 49.9,72 R11.1
  Bottom 0.254: 35.1,72.1 v35,72 v49.07,72 | v37.05,55.76 v37.04,55.76 v34.75,55.76
IN03
  Top 0.254: IC19.4 55.5,38 55,37.5 IC7.55
LED_5V_0  (via drill 0.35 pad 0.65)
  Top 0.406: IC8.7 42.23,80.85 C35.1 40.01,80.87 v40,80.88 | 38.65,80.87 L3.2
  Top 0.813: 38.65,80.87 39.99,80.87 v40,80.88
  Bottom 0.813: v40,80.88 78,80.88 79,79.88 X1.P1
LED_5V_1  (via drill 0.35 pad 0.65)
  Top 0.305: 42.23,69.99 C40.1
  Top 0.406: 38.66,69.99 L4.2 | IC11.7 42.23,69.92 C40.1 42.17,70 v40,70
  Top 0.813: 38.66,69.99 v39.99,69.99 v40,70
  Bottom 0.813: v40,70 78.25,70 X2.P1
LED_DATA  (via drill 0.35 pad 0.65)
  Top 0.254: IC7.20 33.75,38 33.25,38.5 33.25,59 33,59.25 v33,59.5 | IC6.2 73,59 v72.5,59.5
  Bottom 0.254: v72.5,59.5 v33,59.5
LED_RTN0
  Top 1.016: Q2.2 Q2.4 73.55,73.75 X1.P2
LED_RTN1
  Top 1.016: Q4.2 Q4.4 73.32,65.75 X2.P2
N$1
  Top 0.406: Q4.1 64.15,66.54 63.11,65.5 52.65,65.5 R19.2 51.8,66.35 Q3.3
N$2
  Bottom 0.254: Q16.1 14.68,11.06 R45.2
N$3  (via drill 0.35 pad 0.65)
  Top 0.305: R24.2 72.89,18.86 Q6.C 72.86,18.28 v73.03,18.2
  Bottom 0.305: Q8.1 72.92,18.19 72.86,18.25 72.86,18.28 v73.03,18.2
N$4
  Bottom 0.254: Q17.1 31.21,11.1 R46.2
N$5
  Top 0.305: Q6.B 69.2,19.49 R22.2
N$6
  Bottom 0.254: Q18.1 47.71,11.1 R47.2
N$7  (via drill 0.35 pad 0.65)
  Top 0.305: R29.2 73.24,27.78 73.22,27.78 Q9.C 73.22,24.94 v73.43,24.65
  Bottom 0.254: 73.22,24.86 v73.43,24.65
  Bottom 0.305: Q11.1 72.89,25.19 v73.43,24.65
N$8
  Top 0.305: 68.64,26.28 R27.2 68.67,26.28 Q9.B
N$9  (via drill 0.35 pad 0.65)
  Top 0.305: v73.02,11.12 72.86,11.31 Q10.C 72.99,11.83 72.99,13.79 R30.2
  Bottom 0.305: Q12.1 72.22,11.19 Q10.C 72.86,11.15 v73.02,11.12
N$10
  Top 0.305: Q10.B R28.2
N$11
  Top 0.406: R12.2 51.8,77 | 51.8,77 51.8,75.08 Q1.3 | 62.5,76.89 51.91,76.89 51.8,77 | Q2.1 64.1,77.81 63.18,76.89 62.5,76.89 | 62.5,76.89
N$12
  Top 0.254: RTRIM.2 23.5,72.95 CTUNE.2
  Top 0.305: IC2.P5 18.7,74.1 19.85,72.95 RTRIM.2
N$13
  Top 0.305: IC6.4 76.05,56.05 R7.2
N$14
  Top 0.254: RTUNE.1 23.38,74.75 CTUNE.1
N$15
  Top 0.254: R9.2 C34.1
  Top 0.305: R9.2 46.99,74.87 46.61,75.25 43.98,75.25 43.54,74.81 43.54,73.42 IC8.3
N$16
  Top 0.254: IC2.P1 21.75,80.9 R2.1
N$18
  Top 0.254: R49.1 65.5,45.15 R48.2 65.49,44.86 C50.2
N$19
  Top 0.254: IC18.1 70.76,43.1 70.01,43.1 69.54,43.57 69.54,44.53 69.12,44.95 IC18.4 | 68.14,45 IC18.4 | IC18.4 66.7,44.95 R48.1
N$20  (via drill 0.35 pad 0.65)
  Top 0.254: R6.2 v34,71.5 C17.2 R5.1 | IC5.P5 30.48,70.5 30.62,70.65 v30.64,70.64
  Bottom 0.254: v30.64,70.64 33.64,70.64 34,71 v34,71.5
N$21
  Top 0.254: C38.1 46.98,62.94 R15.2
  Top 0.305: 46.98,63.02 R15.2 46.98,62.97 46.98,63.46 46.57,63.87 43.89,63.87 43.48,63.46 43.48,61.9 IC11.3
N$22
  Top 1.016: RI1.1 RI2.2
N$23
  Top 0.254: R8.1 6.79,16.93 STATE.A
N$24
  Top 0.508: R1.1 20.5,70.5 21,70 C3.+
N$25  (via drill 0.35 pad 0.65)
  Top 0.305: R23.2 73.23,35.22 Q5.C 73.23,31.84 v73.33,31.68
  Bottom 0.305: Q7.1 72.83,32.19 v73.33,31.68 73.23,31.78
N$27
  Top 0.305: Q5.B 68.6,33.52 R21.2
N$28  (via drill 0.35 pad 0.65)
  Top 0.254: v52.59,72.05 52.56,72.08 51,72.08 | R11.2 51,71.95 51,72.08 | Q1.1 51,73.08 51,72.08
  Bottom 0.254: C37.1 51.15,72.31 51.28,72.17 52.47,72.17 v52.59,72.05
N$29  (via drill 0.35 pad 0.65)
  Top 0.254: IC18.3 70.88,45.02 71.98,45.02 v72,45 v72.01,45.01
  Bottom 0.254: R50.1 73.31,46.58 73.31,45 | 73.31,45 R51.2 | v72.01,45.01 73.3,45.01 73.31,45
N$30  (via drill 0.35 pad 0.65)
  Top 0.254: Q3.1 51.21,61.75 R20.2 51.23,60.55 52.24,60.55 v52.25,60.55
  Bottom 0.254: C43.1 51.15,60.85 51.45,60.55 52.24,60.55 v52.25,60.55
N$38
  Top 0.305: 16.04,43.51 C13.1
  Top 0.356: IC4.17 16.04,43.51
N$39
  Top 0.305: IC1.P$5 20.92,48.36 21.64,49.09 21.64,50.36 21.01,50.99 21.49,50.99 L2.2 | 9.66,49.49 8.83,49.51 USB.P$1 | C5.1 11.92,51.12
  Top 0.406: 21.01,50.99 11.79,50.99 | 11.79,50.99 11.16,50.99 9.66,49.49 | 11.92,51.12 11.79,50.99
N$40
  Top 0.254: IC1.P$1 14.39,49.31 13.92,48.84 10.5,48.84 10.37,48.84 8.87,48.84 USB.P$2
N$45
  Top 1.016: RI3.1 RI4.2
N$47
  Top 0.305: RX.A R4.1
N$48
  Top 0.305: IC4.23 17.89,39.61 17.58,39.31 17.58,38.04 16.05,36.51 15.54,36.51 TX.K
N$49
  Top 0.305: IC4.22 17.52,40.26 16.82,39.56 16.82,39.31 16.31,38.8 15.55,38.8 RX.K
N$50
  Top 0.254: IC1.P$3 14.35,47.41 13.82,47.94 8.8,47.94
  Top 0.305: 8.81,47.93 USB.P$3 8.8,47.94
N$56
  Bottom 0.254: R18.1 C41.2 73.1,5.65 R16.2
N$58
  Bottom 0.254: IC10.4 81.69,4.26 81.69,5.27 81.26,5.7 79.51,5.7 | 79.8,6.85 IC10.1 79.81,6 79.51,5.7 | R16.1 79.51,5.7
N$59
  Top 0.305: 8.51,51.63 USB.SHIELD_4
  Top 0.406: CUSB.1 8.51,51.63
N$61
  Top 0.305: 3.22,51.62 USB.SHIELD_1
  Top 0.406: RUSB.1 3.22,51.62
N$62
  Top 0.305: TX.A R3.1
N$64
  Bottom 0.254: R14.2 R13.1 81.71,8.94 81.71,6.85 IC10.3
OSC1
  Top 0.254: OSC1.P$3 IC7.92
P5.45V
  Top 0.152: IC5.P8 28.52,72.73 28.13,73.13
  Top 0.254: RTUNE.2 18.25,76.05 IC2.P4
  Top 0.406: IC5.P2 IC5.P1
  Top 0.61: 27.49,66.6 IC5.P1
  Top 0.813: 28,76.25 28.13,76.12 C14.1 28.13,73.13 27,72 27,67.09 27.49,66.6
  Top 1.27: C9.1 28,76.25 C8.1 | 26.7,76.25 C8.1 | C8.1 19.45,76.25 19,75.8 IC2.P4
PDI-CLK  (via drill 0.35 pad 0.65)
  Top 0.305: IC7.90 45,52.5 v45.5,53
  Bottom 0.305: v45.5,53 56.75,53 57.22,53.47 PDI.5
PDI-DATA  (via drill 0.35 pad 0.65)
  Top 0.305: IC7.89 45.5,51.5 v46,52 | PDI.1 52.14,52.39 51.75,52 v51,52
  Bottom 0.305: v46,52 v51,52
PK0_IN  (via drill 0.35 pad 0.65)
  Top 0.254: IC7.29 41.5,32.25 v41.25,32 | v16.5,31.75 IC12.4
  Bottom 0.254: v41.25,32 16.75,32 v16.5,31.75
PK0_IO  (via drill 0.35 pad 0.65)
  Top 0.254: IC7.30 42,31.5 v41.75,31.25 | R35.2 22.6,26.4 22.25,26.75 22.25,31 v22.5,31.25 | Q15.2 24.91,31.07 25.12,31.28 25.03,31.28 v25,31.25
  Bottom 0.254: v41.75,31.25 v25,31.25 v22.5,31.25
PK0_OUT  (via drill 0.35 pad 0.65)
  Top 0.254: IC7.31 42.5,30.75 v42.25,30.5 | IC13.2 21,27.5 | 21,27.5 21,30.25 v21.25,30.5 | R40.2 21,27.5
  Bottom 0.254: v42.25,30.5 v21.25,30.5
PK0_VAL  (via drill 0.35 pad 0.65)
  Top 0.254: IC7.32 43,30 v42.75,29.75 | v10.5,29 10.5,13.59 v10.26,13.33
  Bottom 0.254: v42.75,29.75 15,29.75 14.38,29.12 10.62,29.12 v10.5,29 | R45.1 10.47,11.08 10.25,11.3 10.25,13.07 v10.26,13.33
PK1_IN  (via drill 0.35 pad 0.65)
  Top 0.254: IC7.39 46.5,28.75 v46.25,28.5 | IC14.4 33,28.25 v33.25,28.5
  Bottom 0.254: v46.25,28.5 v33.25,28.5
PK1_IO
  Top 0.254: IC7.40 47,28 46.5,27.5 46.5,26 46.28,25.78 43.25,25.78 | R33.2 43.25,25.78 | 43.25,25.78 Q13.2
PK1_OUT  (via drill 0.35 pad 0.65)
  Top 0.254: IC7.41 47.5,27.25 v47.25,27 | IC15.2 37.5,26 | 37.5,26 37.5,26.75 v37.75,27 | R42.2 37.42,25.92 37.5,26
  Bottom 0.254: v47.25,27 v37.75,27
PK1_VAL  (via drill 0.35 pad 0.65)
  Top 0.254: IC7.42 48,26.5 v47.75,26.25 | v28,13.25 28,24 v28.25,24.25
  Bottom 0.254: v47.75,26.25 30.75,26.25 30.5,26 30.5,24.5 30.25,24.25 v28.25,24.25 | v28,13.25 28,11.35 28.3,11.05 29.86,11.05 R46.1
PK2_IN  (via drill 0.35 pad 0.65)
  Top 0.254: IC7.49 51.5,27.25 v51.25,27 | IC16.4 49.48,26.73 v49.75,27
  Bottom 0.254: v49.75,27 v51.25,27
PK2_IO  (via drill 0.35 pad 0.65)
  Top 0.254: R34.2 60.99,25.61 Q14.2 60.65,33.1 v60.25,33.5 | v52.75,33.5 IC7.50
  Bottom 0.254: v60.25,33.5 v52.75,33.5
PK2_OUT
  Top 0.254: IC7.51 54,26.25 | 54,26.25 IC17.2 | R44.1 54,26.25
PK2_VAL  (via drill 0.35 pad 0.65)
  Top 0.254: IC7.52 54.89,36 55.05,35.84 55.05,25.57 v54.93,25.45 | v44.93,25.15 v44.93,13.25
  Bottom 0.254: v54.93,25.45 45.23,25.45 v44.93,25.15 | R47.1 46.42,11.11 45.26,11.11 44.93,11.44 v44.93,13.25
SERIAL_LED0
  Top 0.305: R7.1 J1.2
STATE  (via drill 0.35 pad 0.65)
  Top 0.254: IC7.1 38,49.25 v37.75,49.5 | v10.25,32.5 9.78,32.03 9.78,20.49 9.5,20.22 R8.2 | v31.25,32.75 31.25,47 31.5,47.25 32.38,47.25 32.62,47.5 32.62,48.88 32.63,48.88 v32.63,49.4
  Bottom 0.254: v10.25,32.5 31,32.5 v31.25,32.75 | v37.75,49.5 37.68,49.57 32.8,49.57 v32.63,49.4
TOG_D00  (via drill 0.35 pad 0.65)
  Top 0.254: IC7.45 49.5,32.51 50,32.01 50,28.5 v50.25,28.25 | 67.84,12.5 65.62,12.5 65.38,12.75 65.38,28 65.12,28.25 v64.38,28.25
  Top 0.406: 67.84,12.5 R28.1
  Bottom 0.254: v50.25,28.25 v64.38,28.25
TOG_D01  (via drill 0.35 pad 0.65)
  Top 0.254: IC7.35 44.5,32.5 45,32 45,29.38 v45.25,29.12 | v65.99,28.31 v66,28.3 66,19.87 66.4,19.47 R22.1
  Top 0.406: R22.1
  Bottom 0.254: v45.25,29.12 65.18,29.12 v65.99,28.31
TOG_D02  (via drill 0.35 pad 0.65)
  Top 0.254: IC7.25 38,33 v38.25,32.75 | 67.31,26.25 R27.1 67.34,26.25 67.34,27.94 65.75,29.53 v65.75,32.75
  Bottom 0.254: v38.25,32.75 v65.75,32.75
TOG_D03  (via drill 0.35 pad 0.65)
  Top 0.254: IC7.15 39.5,40.5 39.75,40.75 39.75,43 v40,43.25 | v64.25,43 64.25,33.76 64.5,33.51 R21.1
  Bottom 0.254: v40,43.25 64,43.25 v64.25,43
USBDM
  Top 0.254: IC1.P$6 17.71,49.31 17.4,49 17.4,45.91 | 18.77,44.22 17.88,44.22 17.4,44.7 17.4,45.91 | C7.1 17.39,45.9 17.4,45.91
  Top 0.305: 18.77,44.22 IC4.16
USBDP
  Top 0.254: IC1.P$4 21.72,47.41 22.28,46.85 | 22.28,46.83 22.28,45.7 21.4,44.82 IC4.15 | C6.1 22.29,46.84
  Top 0.305: IC4.15 | 22.28,46.85 22.28,46.83 22.29,46.84
VAL_PK0
  Bottom 0.406: D1.A 23.23,14.4 J2.7
  Bottom 0.61: J2.7 23.18,13.68 22.5,13 20.5,13 20.16,12.66 Q16.2
  Bottom 1.016: Q16.4 Q16.2
VAL_PK1
  Bottom 0.406: D2.A 39.73,14.4 J3.7
  Bottom 0.61: Q17.2 36.5,12.5 37,13 39.22,13 39.67,13.45 J3.7
  Bottom 1.016: Q17.4 Q17.2
VAL_PK2
  Bottom 0.406: D3.A 56.23,14.4 J4.7
  Bottom 0.61: Q18.2 53,12.5 53.5,13 55.7,13 56.18,13.48 56.18,14.34 J4.7
  Bottom 1.016: Q18.2 Q18.4
VCCIO  (via drill 0.35 pad 0.65)
  Top 0.203: C15.1 28.63,38.49 28.62,38.5
  Top 0.254: Q13.1 41.97,26.03 42.38,25.62 42.38,23.67 42.75,23.3 43.75,23.3 | Q14.1 59.42,25.95 60,25.38 60,23.6 60.27,23.32 | 46,41.75 v46,41.5 | D4.A 60.27,23.32 | C53.1 61.56,36.39 61.83,36.12 61.83,23.52 v61.63,23.32 61.08,23.32 R34.1 60.36,23.4 60.27,23.32 | IC19.5 61.02,37.93 | IC7.65 55,42.5 55.5,42
  Top 0.305: 28.81,49.84 C16.1 | C21.1 36.19,41.21 v36.19,40.59 36.19,41 IC7.14 | v36.15,36.5 C22.1 36.31,35.99 IC7.24 | IC7.34 C23.1 44,31.23 v44.02,31.21 44.02,39.52 45.38,40.88 | v49.01,31.33 v49.01,31.34 C24.1 49.01,33.49 IC7.44 49,38.5 46.71,40.79 v46,41.5 | v56.85,37 C26.1 IC7.54 | IC7.54 | v55.85,41.5 C28.1 55.5,42 IC7.64 | v55.85,41.5 | C30.1 IC7.74 51.5,47 v46,41.5 | C31.1 IC7.83 | C31.1 48.5,46 46,43.5 46,41.75 | OSC1.P$4 C20.1 49.27,55.02 49.75,55.5 | IC12.5 12.5,23.3 C44.1 | 47.54,23.29 IC16.5 C48.1 | C46.1 29.5,23.05 29.75,23.3 IC14.5 | R35.1 23.25,23.55 v23.5,23.3 | R33.1 43.25,23.55 43.5,23.3 43.75,23.3 v44.11,23.3 v44.11,23.29 | 45.38,40.88 | 45.38,40.88 v46,41.5 | 49.75,55.5 49.75,56.38 50.03,56.66 PDI.2 | C31.1 49.6,51.35 49.75,51.5 49.75,55.5 | 38.81,55.68 R10.1 38.96,55.69 v38.96,54.9 38.96,54.1 R17.1 | v32.38,54.62 32.38,50.06 32.17,49.85 C32.1 | 61.02,37.93 C53.1 | C48.1 | v46,23.81 46.05,23.76 C48.1 | Q15.1 25.6,27.59 26,27.2 v26,23.43
  Top 0.356: IC4.4 28.62,38.31
  Top 0.406: C15.1 28.63,34.97 28.75,34.84 v29.16,34.84 | CLKIN.1 6.76,34.17 9.83,34.17 v10.51,34.84 | 12.5,23.3 v11.31,23.3 | C46.1 v29.5,23.3 | v18.25,23.3 18.75,23.8 18.75,34.59 v18.5,34.84 | 28.62,38.31 28.62,38.5 28.62,41.8 28.84,42.03 | 28.84,42.03 29.81,43 29.81,49.79 29.75,49.85 | C32.1 29.75,49.85 | 29.75,49.85 29.14,49.85 C16.1 | v28.88,42 | v28.88,42 28.84,42.03
  Top 0.61: IC3.5 28.81,49.84
  Bottom 0.152: v46,23.81 46,23.31
  Bottom 0.254: 46,23.31
  Bottom 0.305: 39.5,36.5 | 39.5,36.5 v36.15,36.5 | v56.85,37 52,37 50.5,37 v46,41.5 | v55.85,41.5 v46,41.5 | 39.5,36.5 41,36.5 44.99,40.49 | v26,23.43 26.13,23.3 | 44.99,40.49 36.28,40.49 v36.19,40.59 | v46,41.5 44.99,40.49 | v38.96,54.9 38.94,54.88 32.62,54.88 v32.38,54.62 | 44.99,40.49 | 47.5,23.31 46.01,23.31 46,23.31
  Bottom 0.406: v10.51,34.84 v18.5,34.84 v29.16,34.84 | v11.31,23.3 v18.25,23.3 v23.5,23.3 26.13,23.3 v29.5,23.3 v29.51,23.3 46,23.31 47,23.31 47.5,23.31 v61.63,23.32 47,23.32 | 46,23.31 v46,23.81 | v44.11,23.29 | 46,23.31 v44.11,23.29 | v28.88,42 45.5,42 v46,41.5
VDD  (via drill 0.35 pad 0.65)
  Top 0.254: D4.C 62.48,21.27 62.5,21.25
  Top 0.305: C25.1 36.14,45.99 36.15,46 IC7.4 v40.75,46 | C27.1 IC7.94 43,46.5 42.5,46 v40.75,46 | C29.1 38.75,48.5 40.75,46.5 v40.75,46 | IC18.5 68.19,41.62 C52.1 68.21,40.71 v68,40.5
  Top 0.406: v62.5,9.75 62.5,21.25 v62.5,40.5 62.5,45.25 v62.25,45.5 | v61.5,6.25 61.5,4.5 62,4 64.5,4 65,3.5 77.7,3.5 v77.9,3.7
  Bottom 0.203: C36.1 61.65,7.4
  Bottom 0.254: C39.1 79.66,4.5 IC10.5
  Bottom 0.305: IC9.5 62.35,9.6 v62.5,9.75 | v68,40.5 v62.5,40.5
  Bottom 0.406: v40.75,46 41.01,45.74 62.01,45.74 v62.25,45.5 | IC9.5 61.55,7.6 C36.1 61.5,7.47 v61.5,6.25 | v77.9,3.7 C39.1

## Text on the board
tPlace: Licensed under the TAPR Open / Hardware License (www.tapr.org/OHL) / / Copyright 2021 Hardware Platform | Licensed under the TAPR Open Hardware / License (www.tapr.org/OHL) | A | LED1 | . | K | A | LED0 | K | . | RGB LED | 12V / Only! | harp behavior v2.0 | 5V | Hardware Platform | S | www.cf-hw.org | G | 5V Inputs | AD1 | GND | + | DI3 | 5V Outputs | DO3 | DO2 | GND | DO1 | DO0 | GND | PORT0 | PORT2 | GND | AD0 | GND | +5V